# EAGLE design dev (EAGLE 8.5.0)
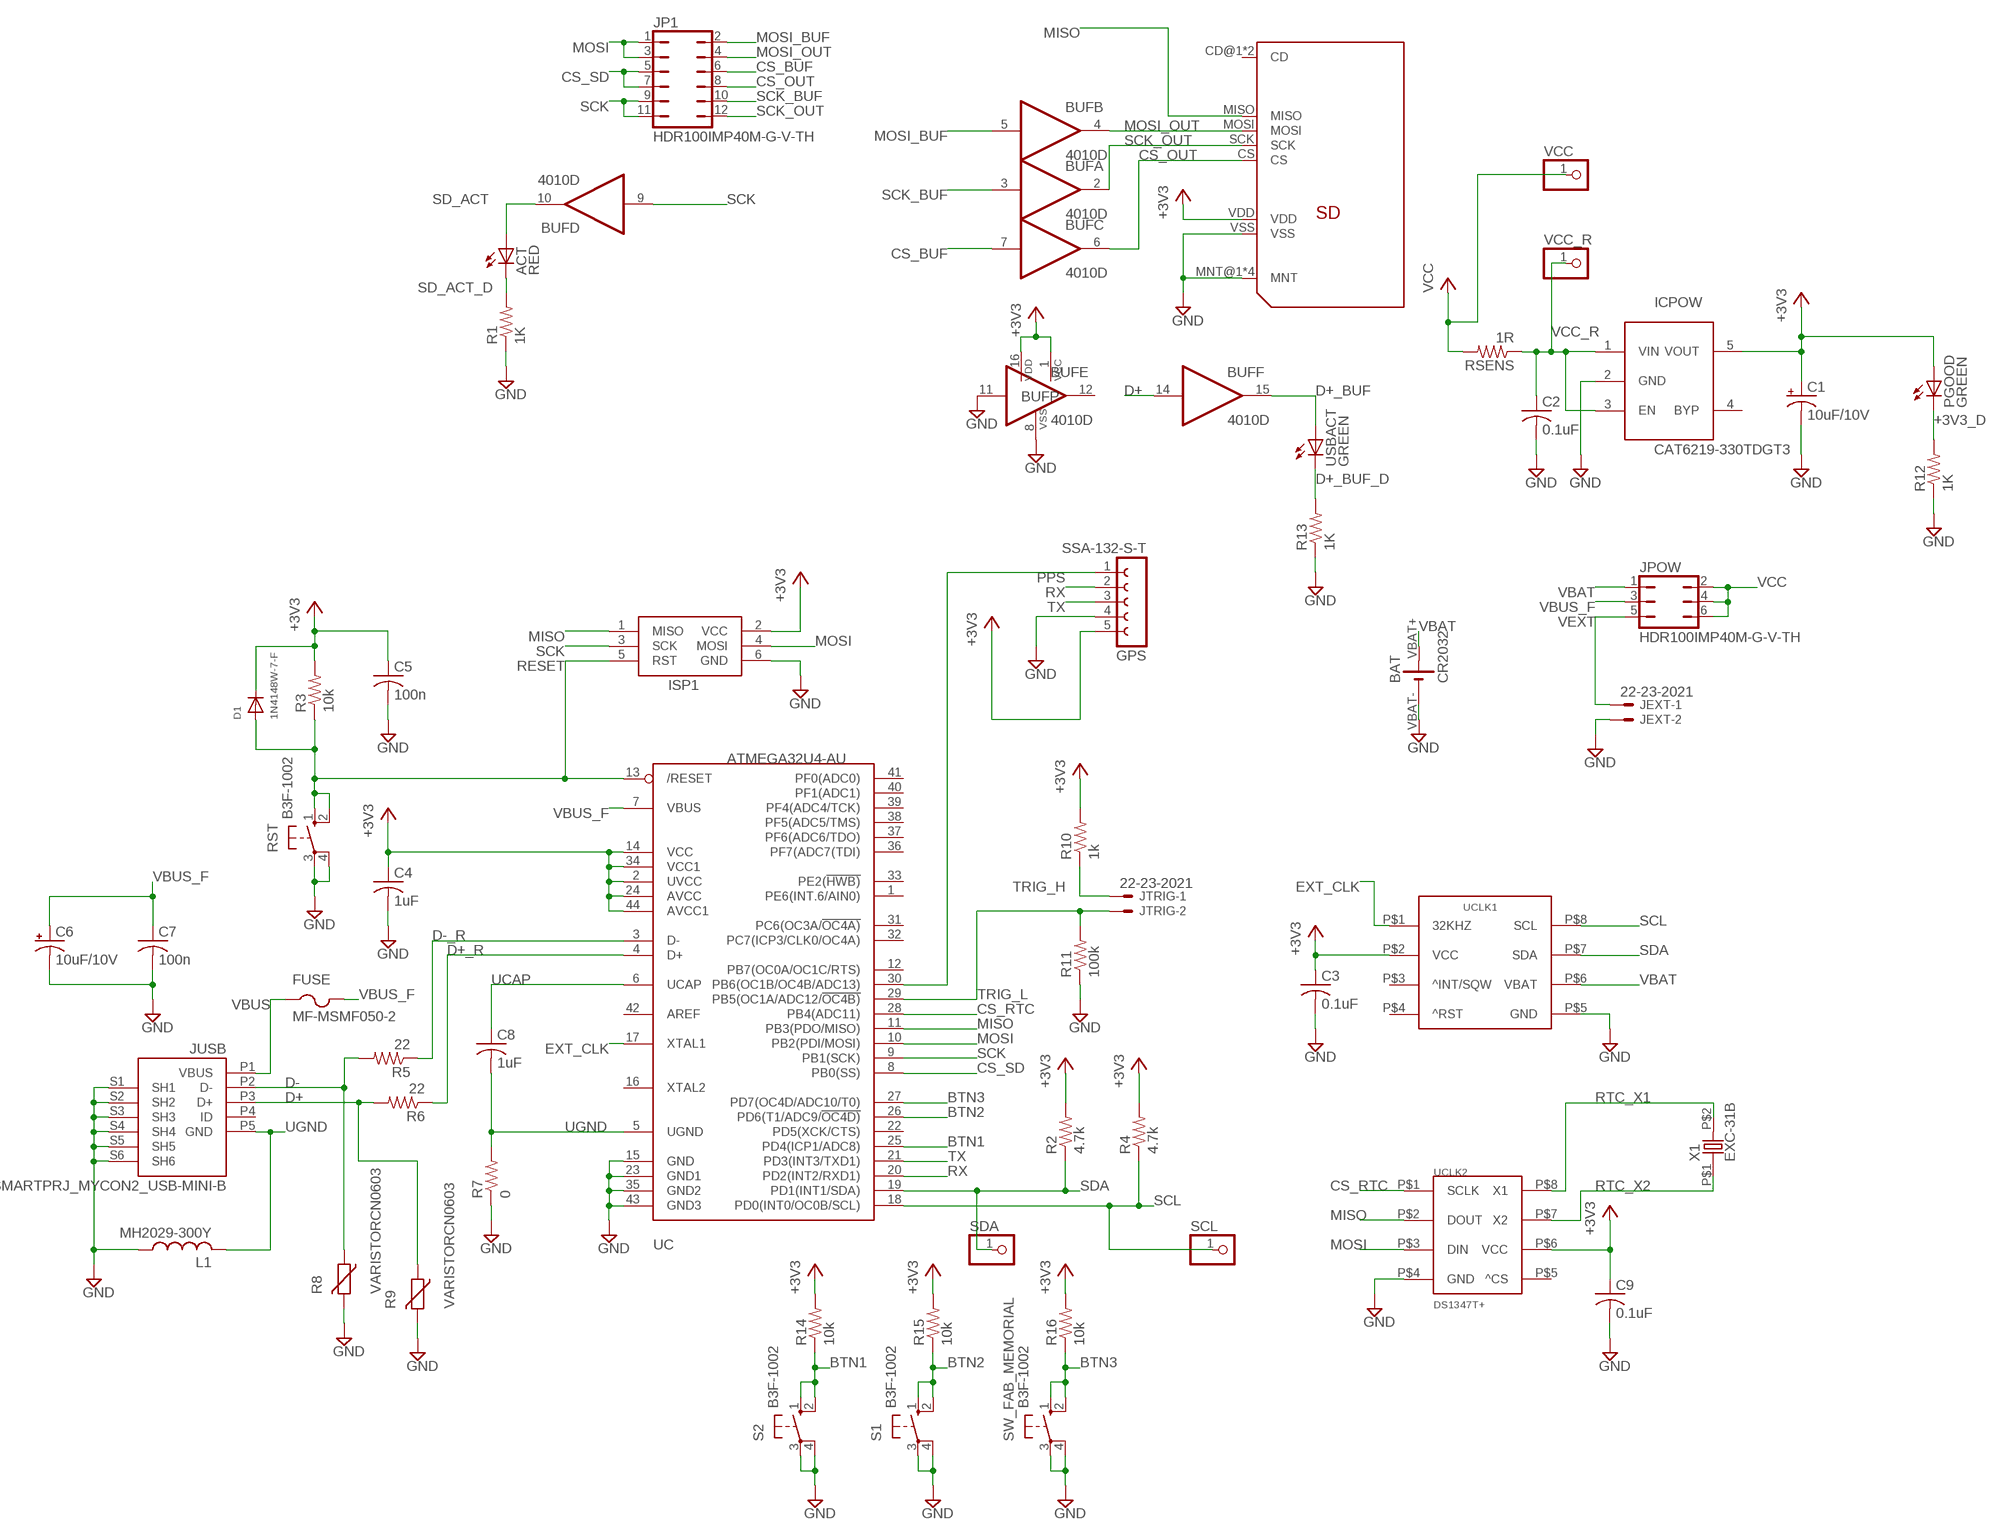
[diagram p0: schematic, sheet 1]

## Parts
ACT  RED  LEDCHIP-LED0603  [CHIP-LED0603]
BAT  CR2032  [BS-7]
BUF  4010D  [SO16]
C1  10uF/10V  CPOL-USA/3216-18R  [A/3216-18R]
C2  0.1uF  C-USC0603K  [C0603K]
C3  0.1uF  C-USC0603K  [C0603K]
C4  1uF  C-USC0603  [C0603]
C5  100n  C-USC0603  [C0603]
C6  10uF/10V  CPOL-USA/3216-18R  [A/3216-18R]
C7  100n  C-USC0603  [C0603]
C8  1uF  C-USC0603  [C0603]
C9  0.1uF  C-USC0603K  [C0603K]
D1  1N4148W-7-F  DIODESOD-123  [SOD-123]
FUSE  MF-MSMF050-2  PTCFUSE-1812  [1812]
GPS  SSA-132-S-T  FE05-1  [FE05-1]
ICPOW  CAT6219-330TDGT3  LP298XS  [SOT23-5L]
ISP1  AVRISP-6  [AVRISP]
JEXT  22-23-2021  [22-23-2021]
JP1  HDR100IMP40M-G-V-TH  JP6Q  [JP6Q]
JPOW  HDR100IMP40M-G-V-TH  JP3Q  [JP3Q]
JTRIG  22-23-2021  [22-23-2021]
JUSB  SMARTPRJ_MYCON2_USB-MINI-B  [SMARTPRJ_CON2_USB_MICRO_B_AT]
L1  MH2029-300Y  [C0805]
PGOOD  GREEN  LEDCHIP-LED0603  [CHIP-LED0603]
R1  1K  R-US_R0603  [R0603]
R2  4.7k  R-US_R0603  [R0603]
R3  10k  R-US_R0603  [R0603]
R4  4.7k  R-US_R0603  [R0603]
R5  22  R-US_R0603  [R0603]
R6  22  R-US_R0603  [R0603]
R7  0  R-US_R0603  [R0603]
R8  VARISTORCN0603  [CT/CN0603]
R9  VARISTORCN0603  [CT/CN0603]
R10  1k  R-US_R0603  [R0603]
R11  100k  R-US_R0603  [R0603]
R12  1K  R-US_R0603  [R0603]
R13  1K  R-US_R0603  [R0603]
R14  10k  R-US_R0603  [R0603]
R15  10k  R-US_R0603  [R0603]
R16  10k  R-US_R0603  [R0603]
RSENS  1R  R-US_R0603  [R0603]
RST  B3F-1002  10-XX  [B3F-10XX]
S1  B3F-1002  10-XX  [B3F-10XX]
S2  B3F-1002  10-XX  [B3F-10XX]
SCL  PINHD-1X1  [1X01]
SDA  PINHD-1X1  [1X01]
SW_FAB_MEMORIAL  B3F-1002  10-XX  [B3F-10XX]
U$1  MICROSD  [MICROSD]
UC  ATMEGA32U4-AU  [TQFP44]
UCLK1  DS3231MDS3231MZ+  [S8MK+1]
UCLK2  DS1347T+  [8_TDFN-EP]
USBACT  GREEN  LEDCHIP-LED0603  [CHIP-LED0603]
VCC  PINHD-1X1  [1X01]
VCC_R  PINHD-1X1  [1X01]
X1  EXC-31B  [XTAL-SM2]

## Nets
+3V3: BUF.1(P:VCC) BUF.16(P:VDD) C1.+ C3.1 C4.1 C5.1 C9.1 D1.C GPS.5 ICPOW.5(VOUT) ISP1.2(VCC) PGOOD.A R2.2 R3.2 R4.2 R10.2 R14.2 R15.2 R16.2 U$1.VDD UC.2(UVCC) UC.14(VCC) UC.24(AVCC) UC.34(VCC1) UC.44(AVCC1) UCLK1.P$2(VCC) UCLK2.P$6(VCC)
+3V3_D: PGOOD.C R12.2
BTN1: R14.1 S2.1(S) S2.2(S1) UC.25(PD4(ICP1/ADC8))
BTN2: R15.1 S1.1(S) S1.2(S1) UC.26(PD6(T1/ADC9/!OC4D))
BTN3: R16.1 SW_FAB_MEMORIAL.1(S) SW_FAB_MEMORIAL.2(S1) UC.27(PD7(OC4D/ADC10/T0))
CS_BUF: BUF.7(C:I) JP1.6
CS_OUT: BUF.6(C:O) JP1.8 U$1.CS
CS_RTC: UC.28(PB4(ADC11)) UCLK2.P$1(SCLK)
CS_SD: JP1.5 JP1.7 UC.8(PB0(SS))
D+: BUF.14(F:I) JUSB.P3(D+) R6.2 R9.1
D+_BUF: BUF.15(F:O) USBACT.A
D+_BUF_D: R13.2 USBACT.C
D+_R: R6.1 UC.4(D+)
D-: JUSB.P2(D-) R5.2 R8.1
D-_R: R5.1 UC.3(D-)
EXT_CLK: UC.17(XTAL1) UCLK1.P$1(32KHZ)
GND: BAT.VBAT-(-) BUF.8(P:VSS) BUF.11(E:I) C1.- C2.2 C3.2 C4.2 C5.2 C6.- C7.2 C9.2 GPS.4 ICPOW.2(GND) ISP1.6(GND) JEXT.2 JUSB.S1(SH1) JUSB.S2(SH2) JUSB.S3(SH3) JUSB.S4(SH4) JUSB.S5(SH5) JUSB.S6(SH6) L1.1 R1.1 R7.1 R8.2 R9.2 R11.1 R12.1 R13.1 RST.3(P) RST.4(P1) S1.3(P) S1.4(P1) S2.3(P) S2.4(P1) SW_FAB_MEMORIAL.3(P) SW_FAB_MEMORIAL.4(P1) U$1.MNT@1(MNT) U$1.MNT@2(MNT) U$1.MNT@3(MNT) U$1.MNT@4(MNT) U$1.VSS UC.15(GND) UC.23(GND1) UC.35(GND2) UC.43(GND3) UCLK1.P$5(GND) UCLK2.P$4(GND)
MISO: ISP1.1(MISO) U$1.MISO UC.11(PB3(PDO/MISO)) UCLK2.P$2(DOUT)
MOSI: ISP1.4(MOSI) JP1.1 JP1.3 UC.10(PB2(PDI/MOSI)) UCLK2.P$3(DIN)
MOSI_BUF: BUF.5(B:I) JP1.2
MOSI_OUT: BUF.4(B:O) JP1.4 U$1.MOSI
PPS: GPS.1 UC.30(PB6(OC1B/OC4B/ADC13))
RESET: D1.A ISP1.5(RST) R3.1 RST.1(S) RST.2(S1) UC.13(/RESET)
RTC_X1: UCLK2.P$8(X1) X1.P$2
RTC_X2: UCLK2.P$7(X2) X1.P$1
RX: GPS.2 UC.20(PD2(INT2/RXD1))
SCK: BUF.9(D:I) ISP1.3(SCK) JP1.9 JP1.11 UC.9(PB1(SCK))
SCK_BUF: BUF.3(A:I) JP1.10
SCK_OUT: BUF.2(A:O) JP1.12 U$1.SCK
SCL: R4.1 SCL.1 UC.18(PD0(INT0/OC0B/SCL)) UCLK1.P$8(SCL)
SD_ACT: ACT.A BUF.10(D:O)
SD_ACT_D: ACT.C R1.2
SDA: R2.1 SDA.1 UC.19(PD1(INT1/SDA)) UCLK1.P$7(SDA)
TRIG_H: JTRIG.1 R10.1
TRIG_L: JTRIG.2 R11.2 UC.29(PB5(OC1A/ADC12/!OC4B))
TX: GPS.3 UC.21(PD3(INT3/TXD1))
UCAP: C8.1 UC.6(UCAP)
UGND: C8.2 JUSB.P5(GND) L1.2 R7.2 UC.5(UGND)
VBAT: BAT.VBAT+(+) JPOW.1 UCLK1.P$6(VBAT)
VBUS: FUSE.1 JUSB.P1(VBUS)
VBUS_F: C6.+ C7.1 FUSE.2 JPOW.3 UC.7(VBUS)
VCC: JPOW.2 JPOW.4 JPOW.6 RSENS.2 VCC.1
VCC_R: C2.1 ICPOW.1(VIN) ICPOW.3(EN) RSENS.1 VCC_R.1
VEXT: JEXT.1 JPOW.5
Unconnected: BUF.12(E:O) ICPOW.4(BYP) JUSB.P4(ID) U$1.CD@1(CD) U$1.CD@2(CD) UC.1(PE6(INT.6/AIN0)) UC.12(PB7(OC0A/OC1C/RTS)) UC.16(XTAL2) UC.22(PD5(XCK/CTS)) UC.31(PC6(OC3A/!OC4A)) UC.32(PC7(ICP3/CLK0/OC4A)) UC.33(PE2(!HWB)) UC.36(PF7(ADC7(TDI)) UC.37(PF6(ADC6/TDO)) UC.38(PF5(ADC5/TMS)) UC.39(PF4(ADC4/TCK)) UC.40(PF1(ADC1)) UC.41(PF0(ADC0)) UC.42(AREF) UCLK1.P$3(^INT/SQW) UCLK1.P$4(^RST) UCLK2.P$5(^CS)

## Library data of the parts
ACT PGOOD USBACT = adafruit:LED: LED OSRAM: - CHIPLED LG R971, LG N971, LY N971, LG Q971, LY Q971, LO R971, LY R971 LH N974, LH R974 LS Q976, LO Q976, LY Q976 LO Q996 - Hyper CHIPLED LW Q18S LB Q993, LB Q99A, LB R99A - SideLED LS A670, LO A670, LY A670, LG A670, LP A670 LB A673, LV A673, LT A673, LW A673 LH A674 LY A675 LS A676, LA A676, LO A676, LY A676, LW A676 LS A679, LY A679, LG A679 - Hyper Micro SIDELED® LS Y876, LA Y876, LO Y876, LY Y876 LT Y87S - SmartLED LW L88C, LW L88S LB L89C, LB L89S, LG L890 LS L89K, LO L89K, LY L89K LS L896, LA L896, LO L896, LY L896 - TOPLED LS T670, LO T670, LY T670, LG T670, LP T670 LSG T670, LSP T670, LSY T670, LOP T670, LYG T670 LG T671, LOG T671, LSG T671 LB T673, LV T673, LT T673, LW T673 LH T674 LS T676, LA T676, LO T676, LY T676, LB T676, LH T676, LSB T676, LW T676 LB T67C, LV T67C, LT T67C, LS T67K, LO T67K, LY T67K, LW E67C LS E67B, LA E67B, LO E67B, LY E67B, LB E67C, LV E67C, LT E67C LW T67C LS T679, LY T679, LG T679 LS T770, LO T770, LY T770, LG T770, LP T770 LB T773, LV T773, LT T773, LW T773 LH T774 LS E675, LA E675, LY E675, LS T675 LS T776, LA T776, LO T776, LY T776, LB T776 LHGB T686 LT T68C, LB T68C - Hyper Mini TOPLED® LB M676 - Mini TOPLED Santana® LG M470 LS M47K, LO M47K, LY M47K Source: http://www.osram.convergy.de/
BAT = dorskyee:CR2032
BUF = 40xx:4010: Hex BUFFER, non-inverting Source: www.fairchildsemi.com CD4010.pdf © 2000 Fairchild Semiconductor Corporation DS005945
C1 C6 = adafruit:CPOL-US: POLARIZED CAPACITOR, American symbol
C2 C3 C9 = adafruit:C-US: CAPACITOR, American symbol
C4 C5 C7 C8 = rcl:C-US: CAPACITOR, American symbol; SPICEPREFIX: C
D1 = adafruit:DIODE: Diode SMADIODE - SMA Surface Mount Package 20V 1A Schottky Diode Digikey: 641-1014-6-ND DO-1N4148 - Through Hole Small Current Diode SOD-123 20V 1 A (.5mV Vf) Schottky Diode - Digikey: MBRX120TPMSCT-ND SOD-323 10V 570mA (.38mV Vf, 3ns) Schottky Diode - Digikey: ZLLS410CT-ND SOD-523 30V 30mA Schottky Diode (RB751S-40TE61) - Digikey: RB751S-40TE61CT-ND SOT23-R/W - SOT23 Package (R = Solder Paste/Reflow Ovens, W = Hand-Soldering) BAT54Film 40V 300mA - Digikey: 497-7162-1-ND
FUSE = adafruit:PTCFUSE: PTC fuses, resettable thermistors
GPS = con-lsta:FE05-1: FEMALE HEADER; OC_FARNELL: unknown; OC_NEWARK: unknown
ICPOW = adafruit:LP298X
ISP1 = adafruit:AVRISP: AVR ISP HEADER Standard 6 pin header for AVR programming
JEXT JTRIG = con-molex:22-23-2021: .100" (2.54mm) Center Header - 2 Pin; MF: MOLEX; MPN: 22-23-2021; OC_FARNELL: 1462926; OC_NEWARK: 25C3832
JP1 = jumper:JP6Q: JUMPER
JPOW = jumper:JP3Q: JUMPER
JUSB = dorskyee:SMARTPRJ_MYCON2_USB-MINI-B
L1 = dorskyee:MH2029-300Y
R1 R12 R13 RSENS = adafruit:R-US_: RESISTOR, American symbol
R2-R7 R10 R11 R14-R16 = resistor:R-US_: RESISTOR, American symbol
R8 R9 = varistor:VARISTOR: VARISTOR
RST S1 S2 SW_FAB_MEMORIAL = switch-omron:10-XX: OMRON SWITCH; MPN: B3F-1000; OC_FARNELL: 176432; OC_NEWARK: 36M3542
SCL SDA VCC VCC_R = adafruit:PINHD-1X1: Pin header 1x1 for 0.1" spacing With round pins
U$1 = dorskyee:MICROSD
UC = adafruit:ATMEGA32U4: http://www.ladyada.net/library/eagle
UCLK1 = dorskyee:DS3231M
UCLK2 = dorskyee:DS1347T+
X1 = dorskyee:EXC-31B

## Net classes
0 default: width 0.254 mm, drill 0.305 mm, clearance 0.254 mm
1 power: width 0.254 mm, drill 0.305 mm, clearance 0.254 mm
2 gnd: width 0.254 mm, drill 0.305 mm, clearance 0.254 mm
3 usbvcc: width 0.254 mm, drill 0.305 mm, clearance 0.254 mm
4 aref: width 0.254 mm, drill 0.305 mm, clearance 0.254 mm

## Board
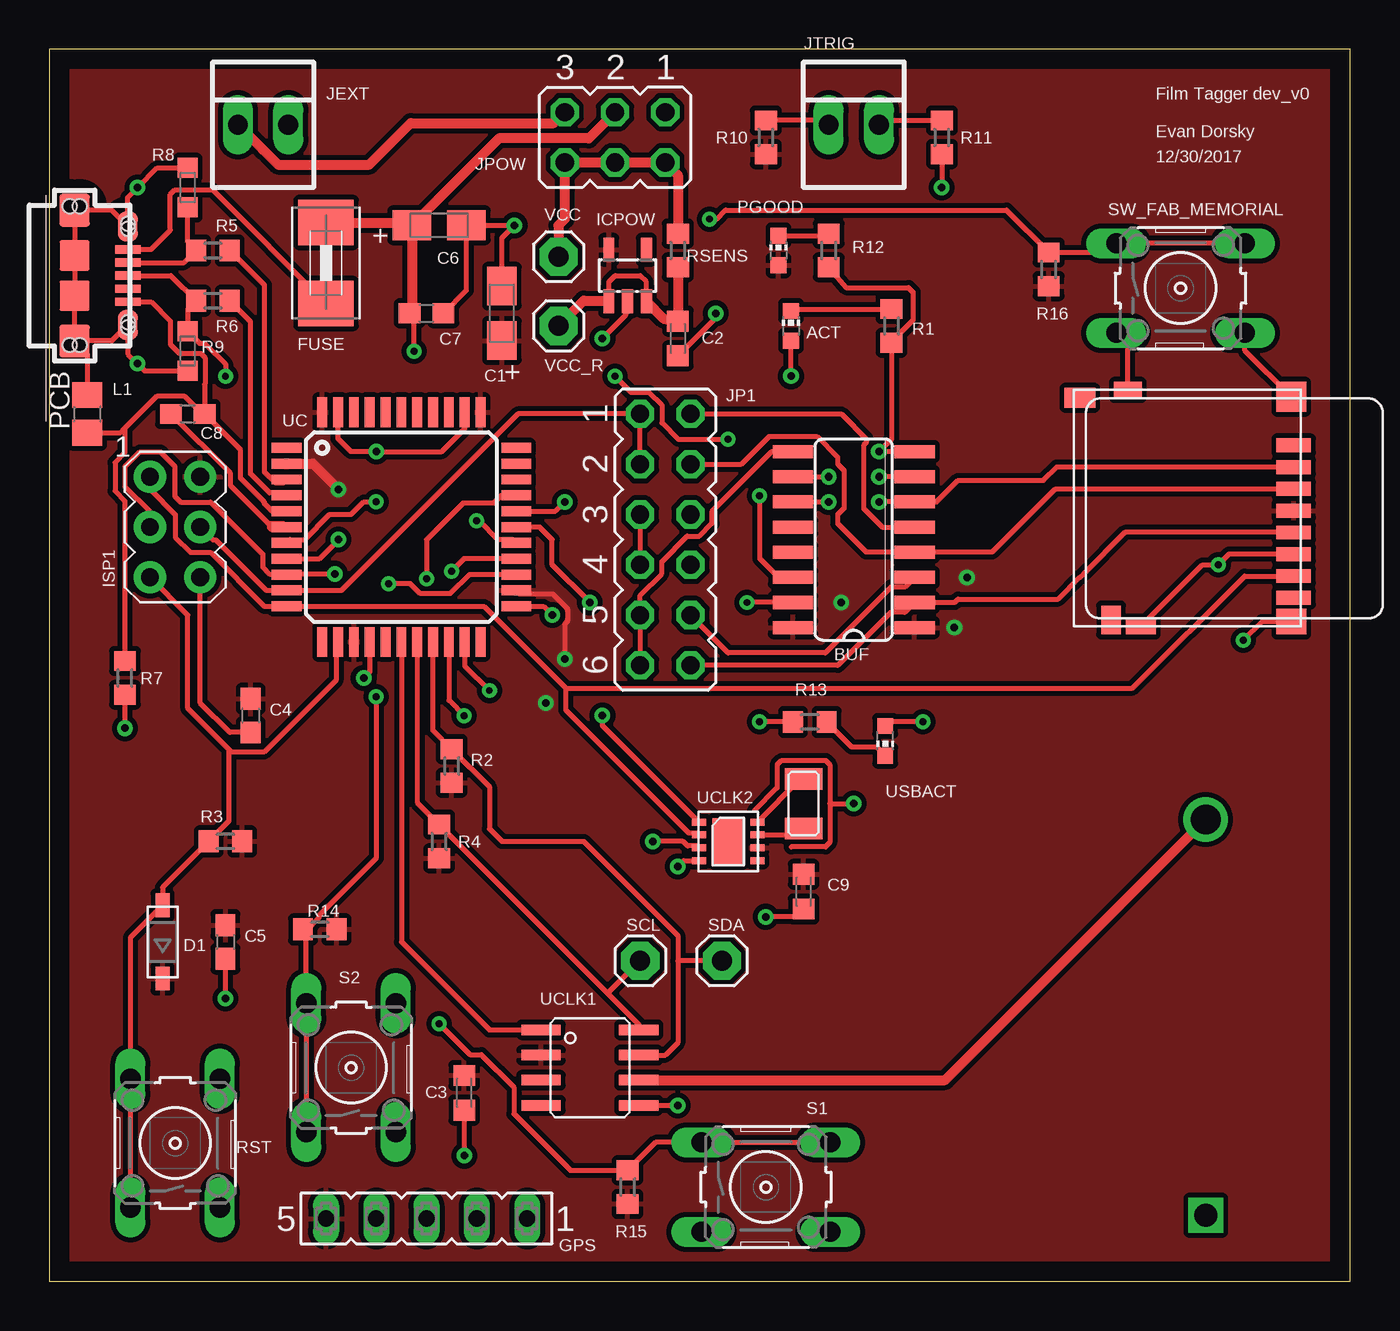
[diagram p1: board, top side]
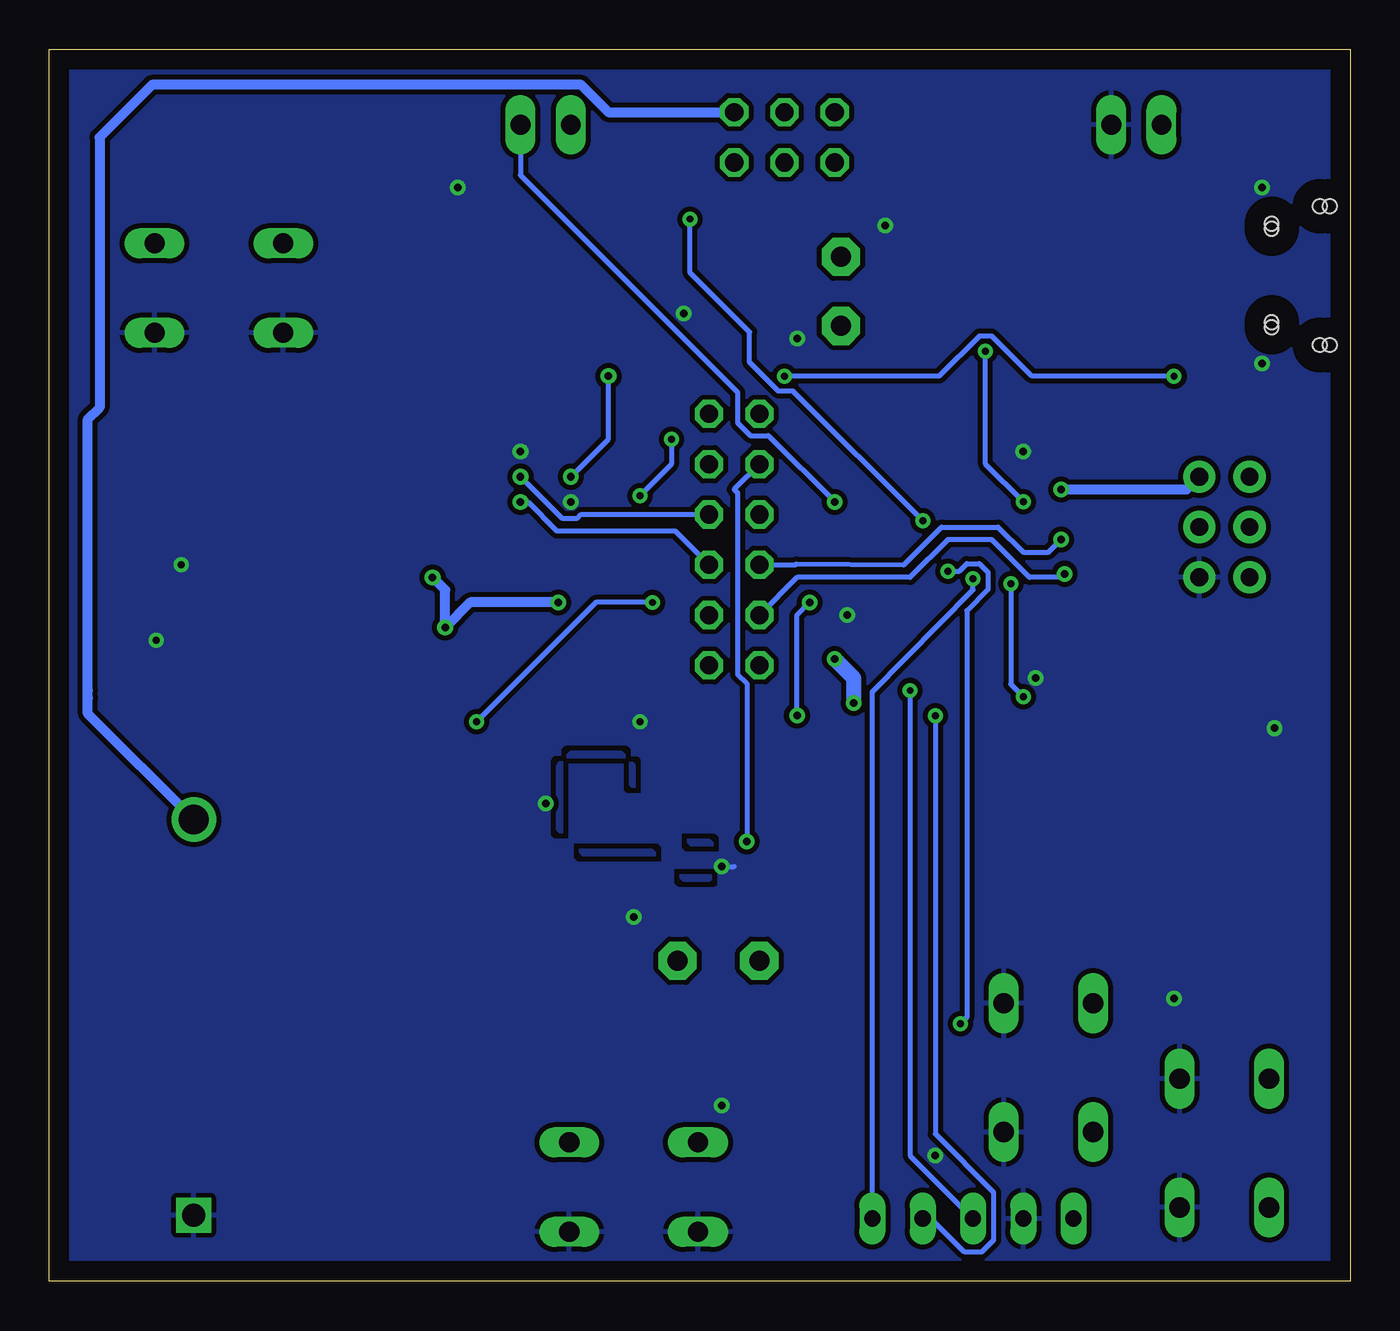
[diagram p2: board, bottom side, seen from below]

Size 65.71 x 62.22 mm. Coordinates in mm from the lower left corner, seen from the top.
Outline: 0,0 65.71,0 65.71,62.22 0,62.22 0,0
Copper layers (1*16): Top 0.035mm / dielectric 1.5mm / Bottom 0.035mm
Design rules "default *": minimum track width 6mil, minimum drill 12mil, track to track 6mil, track to pad 8mil, pad to pad 6mil, via to via 6mil, smd to smd 6mil, copper to edge 40mil, drill to drill 6mil, minimum pad ring 10mil, minimum via ring 8mil, stop-mask expansion 4mil, vias tented up to drill 0mil, thermal gap 10mil

### Footprints (pad centres in the part's own frame; a part is rotated, then mirrored left to right if it is on the bottom)
CHIP-LED0603 = smd 0.8 x 0.8: A 0,-0.75; C 0,0.75
BS-7 = drill 1.5: VBAT+ 10,0 | drill 1.17 square: VBAT- -10,0
SO16 = smd 0.66 x 2.032: 1 -4.445,-3.073; 2 -3.175,-3.073; 3 -1.905,-3.073; 4 -0.635,-3.073; 5 0.635,-3.073; 6 1.905,-3.073; 7 3.175,-3.073; 8 4.445,-3.073; 9 4.445,3.073; 10 3.175,3.073; 11 1.905,3.073; 12 0.635,3.073; 13 -0.635,3.073; 14 -1.905,3.073; 15 -3.175,3.073; 16 -4.445,3.073
A/3216-18R = smd 1.95 x 1.5: + 1.375,0; - -1.375,0
C0603K = smd 1.05 x 1.08: 1 -0.875,0; 2 0.875,0
C0603 = smd 1.1 x 1: 1 -0.85,0; 2 0.85,0
SOD-123 = smd 1.2 x 0.7: A 1.85,0; C -1.85,0
1812 = smd 2.286 x 2.794: 1 -2.046,0; 2 2.046,0
FE05-1 = drill 0.813 long: 1 -5.08,0; 2 -2.54,0; 3 0,0; 4 2.54,0; 5 5.08,0
SOT23-5L = smd 0.55 x 1.2: 1 -0.95,-1.3; 2 0,-1.3; 3 0.95,-1.3; 4 0.95,1.3; 5 -0.95,1.3
AVRISP = drill 0.9 pad 1.626: 1 -1.27,2.54; 2 1.27,2.54; 3 -1.27,0; 4 1.27,0; 5 -1.27,-2.54; 6 1.27,-2.54
22-23-2021 = drill 1 long: 1 -1.27,0; 2 1.27,0
JP6Q = drill 0.914 octagon: 1 -6.35,-1.27; 2 -6.35,1.27; 3 -3.81,-1.27; 4 -3.81,1.27; 5 -1.27,-1.27; 6 -1.27,1.27; 7 1.27,-1.27; 8 1.27,1.27; 9 3.81,-1.27; 10 3.81,1.27; 11 6.35,-1.27; 12 6.35,1.27
JP3Q = drill 0.914 octagon: 1 -2.54,-1.27; 2 -2.54,1.27; 3 0,-1.27; 4 0,1.27; 5 2.54,-1.27; 6 2.54,1.27
SMARTPRJ_CON2_USB_MICRO_B_AT = smd 0.406 x 1.346: P1 -1.321,2.692; P2 -0.66,2.692; P3 0,2.692; P4 0.66,2.692; P5 1.321,2.692 | smd 1.651 x 1.549: S1 -3.302,0; S2 3.302,0 | smd 1.524 x 1.016: S3 -2.489,2.692; S4 2.489,2.692 | smd 1.524 x 1.524: S5 -1.016,0; S6 1.016,0 | hole 0.7: -3.505,0.254; -3.505,-0.254; 3.505,0.254; 3.505,-0.254; -2.616,2.692; -2.362,2.692; 2.362,2.692; 2.616,2.692
C0805 = smd 1.3 x 1.5: 1 -0.95,0; 2 0.95,0
R0603 = smd 1 x 1.1: 1 -0.85,0; 2 0.85,0
CT/CN0603 = smd 1 x 1: 1 -1,0; 2 1,0
B3F-10XX = drill 1.016 long: 1 -3.251,2.261; 2 3.251,2.261; 3 -3.251,-2.261; 4 3.251,-2.261
1X01 = drill 1.016 pad 1.93 octagon: 1 0,0
MICROSD = smd 1 x 1.55: CD@1 2.4,10.8 | smd 1.45 x 1: CD@2 -8.825,9.225 | smd 0.7 x 1.75: CS -1.1,0; MISO -6.6,0; MOSI -2.2,0; NC@1 0,0; NC@2 -7.7,0; SCK -4.4,0; VDD -3.3,0; VSS -5.5,0 | smd 1.3 x 1.5: MNT@1 -8.9,0.125 | smd 0.8 x 1.5: MNT@2 -9.15,7.725 | smd 0.8 x 1.4: MNT@3 2.8,8.375 | smd 1.5 x 1.5: MNT@4 2.45,0.125
TQFP44 = smd 1.5 x 0.5: 1 -5.8,4; 2 -5.8,3.2; 3 -5.8,2.4; 4 -5.8,1.6; 5 -5.8,0.8; 6 -5.8,0; 7 -5.8,-0.8; 8 -5.8,-1.6; 9 -5.8,-2.4; 10 -5.8,-3.2; 11 -5.8,-4; 23 5.8,-4; 24 5.8,-3.2; 25 5.8,-2.4; 26 5.8,-1.6; 27 5.8,-0.8; 28 5.8,0; 29 5.8,0.8; 30 5.8,1.6; 31 5.8,2.4; 32 5.8,3.2; 33 5.8,4 | smd 0.5 x 1.5: 12 -4,-5.8; 13 -3.2,-5.8; 14 -2.4,-5.8; 15 -1.6,-5.8; 16 -0.8,-5.8; 17 0,-5.8; 18 0.8,-5.8; 19 1.6,-5.8; 20 2.4,-5.8; 21 3.2,-5.8; 22 4,-5.8; 34 4,5.8; 35 3.2,5.8; 36 2.4,5.8; 37 1.6,5.8; 38 0.8,5.8; 39 0,5.8; 40 -0.8,5.8; 41 -1.6,5.8; 42 -2.4,5.8; 43 -3.2,5.8; 44 -4,5.8
S8MK+1 = smd 1.98 x 0.53: P$1 -2.465,1.905; P$2 -2.465,0.635; P$3 -2.465,-0.635; P$4 -2.465,-1.905; P$5 2.465,-1.905; P$6 2.465,-0.635; P$7 2.465,0.635; P$8 2.465,1.905
8_TDFN-EP = smd 0.7 x 0.35: P$1 -1.475,0.975; P$2 -1.475,0.325; P$3 -1.475,-0.325; P$4 -1.475,-0.975; P$5 1.475,-0.975; P$6 1.475,-0.325; P$7 1.475,0.325; P$8 1.475,0.975 | smd 1.58 x 2.35: P$9 0,0
XTAL-SM2 = smd 1.1 x 1.9: P$1 -1.25,0; P$2 1.25,0

### Placement (x,y rotation side)
ACT  37.47,48.26 0 top
BAT  58.42,13.34 90 top
BUF  40.64,37.47 90 top
C1  22.86,48.9 270 top
C2  31.75,47.62 270 top
C3  20.95,9.53 270 top
C4  10.16,28.57 270 top
C5  8.89,17.14 270 top
C6  19.68,53.34 180 top
C7  19.05,48.9 0 top
C8  6.99,43.81 0 top
C9  38.1,19.68 270 top
D1  5.71,17.14 90 top
FUSE  13.97,51.44 90 top
GPS  19.05,3.17 180 top
ICPOW  29.21,50.8 0 top
ISP1  6.35,38.1 0 top
JEXT  10.79,58.42 0 top
JP1  31.11,37.47 270 top
JPOW  28.57,57.78 180 top
JTRIG  40.64,58.42 0 top
JUSB  1.27,50.8 270 top
L1  1.91,43.81 270 top
PGOOD  36.83,52.07 0 top
R1  42.55,48.26 90 top
R2  20.32,26.04 270 top
R3  8.89,22.23 0 top
R4  19.68,22.23 270 top
R5  8.26,52.07 180 top
R6  8.26,49.53 180 top
R7  3.81,30.48 90 top
R8  6.99,55.24 90 top
R9  6.99,46.99 270 top
R10  36.2,57.78 270 top
R11  45.09,57.78 90 top
R12  39.37,52.07 90 top
R13  38.42,28.26 0 top
R14  13.65,17.78 0 top
R15  29.21,4.76 270 top
R16  50.48,51.12 270 top
RSENS  31.75,52.07 90 top
RST  6.35,6.99 90 top
S1  36.2,4.76 0 top
S2  15.24,10.79 90 top
SCL  29.84,16.19 0 top
SDA  33.97,16.19 0 top
SW_FAB_MEMORIAL  57.15,50.16 0 top
U$1  62.87,42.23 90 top
UC  17.78,38.1 0 top
UCLK1  27.3,10.79 0 top
UCLK2  34.29,22.23 0 top
USBACT  42.23,27.3 180 top
VCC  25.72,51.75 0 top
VCC_R  25.72,48.26 0 top
X1  38.1,24.13 90 top

### Tracks (layer width: path | path; a pad name or v marks a point on that pad's centre or on a via)
+3V3  (via drill 0.38, 0.38 pad 0.38)
  Top 0.254: UC.24 23.75,34.73 25.42,34.73 26.18,33.98 26.18,33.33 26.04,33.19 v26.04,31.43
  Top 0.508: UC.2 13.31,41.3 v14.61,40.01
  Bottom 0.508: v14.61,40.01 8.26,40.01 ISP1.2 | v40.01,34.29 44.45,34.29 v45.72,33.02 45.72,34.92 v46.35,35.56
  Bottom 0.762: v26.04,31.43 25.08,30.48 v25.08,29.21
  pour Top: 0,62.23 65.41,62.23 65.41,0 0,0
  cutout Top: 35.56,23.5 36.83,24.77 36.83,26.04 39.37,26.04 39.37,22.23 35.56,22.23
  pour Bottom (isolate 0.254, rank 2): 33.66,22.23 36.2,24.77 36.2,26.04 36.83,26.67 39.37,26.67 40.01,26.04 40.01,22.86 38.73,21.59 34.92,21.59 33.66,20.32 32.38,20.32 31.75,20.95 31.75,21.59 32.38,22.23
+3V3_D
  Top 0.254: PGOOD.C 39.27,52.82 R12.2
BTN1  (via drill 0.35)
  Top 0.254: S2.1 S2.2 12.98,17.6 12.91,17.67 | 12.91,17.67 R14.1 | UC.25 21.22,35.7 20.25,34.73 18.74,34.73 18.23,35.24 v17.14,35.24 | 12.91,17.67 13.62,18.38 13.62,18.49 16.51,21.38 v16.51,29.53
  Bottom 0.254: v17.14,35.24 17.14,30.16 v16.51,29.53
BTN2  (via drill 0.35)
  Top 0.254: S1.2 S1.1 30.62,7.02 R15.1 26.32,5.61 23.47,8.47 23.47,9.8 21.81,11.46 21.25,11.46 v19.68,13.02 | UC.26 20.94,36.5 v20.32,35.88
  Bottom 0.254: v20.32,35.88 19.74,35.88 19.36,36.25 18.74,36.25 18.29,35.81 18.29,34.95 19.37,33.88 19.37,13.34 v19.68,13.02
BTN3  (via drill 0.35)
  Top 0.254: SW_FAB_MEMORIAL.2 SW_FAB_MEMORIAL.1 53.44,51.97 R16.1 48.35,54.1 34.17,54.1 33.72,53.66 v33.34,53.66 | UC.27 23.41,37.47 22.67,37.47 21.72,38.42 v21.59,38.42
  Bottom 0.254: v21.59,38.42 28.13,44.96 28.89,44.96 30.34,46.41 30.34,47.95 33.34,50.94 v33.34,53.66
CS_BUF  (via drill 0.38)
  Top 0.254: BUF.7 v41.91,40.64
  Bottom 0.254: JP1.6 38.84,38.73 39.03,38.55 39.82,38.55 v41.91,40.64
CS_OUT  (via drill 0.38)
  Top 0.254: v41.91,39.37 BUF.6 44.82,39.37 45.91,40.46 47.94,40.46 | 47.94,40.46 50.22,40.46 50.89,41.13 U$1.CS | 47.94,40.46
  Bottom 0.254: v41.91,39.37 41.54,39.37 40.08,37.91 34.1,37.91 JP1.8
CS_RTC  (via drill 0.38)
  Top 0.254: UCLK2.P$1 27.94,28.07 v27.94,28.57 | v27.3,34.29 25.4,36.2 25.4,37.47 24.77,38.1 UC.28
  Bottom 0.254: v27.94,28.57 27.94,33.66 v27.3,34.29
CS_SD  (via drill 0.38)
  Top 0.254: UC.8 13.64,36.5 v14.61,37.47 | JP1.5 JP1.7
  Bottom 0.254: JP1.7 28.02,36.2 27.97,36.25 22.54,36.2 20.64,38.1 17.78,38.1 16.51,36.83 15.24,36.83 v14.61,37.47
D+  (via drill 0.35 pad 0.38)
  Top 0.254: JUSB.P3 6.13,50.8 R6.2 6.99,49.11 R9.1 7.6,47.38 7.85,47.38 8.89,46.34 v8.89,45.72 | v34.29,42.55 31.75,42.55 30.94,43.36 30.94,44.27 30.3,44.91 29.39,44.91 v28.57,45.72 | v35.88,39.69 35.88,36.51 36.83,35.56 BUF.14
  Bottom 0.254: v8.89,45.72 16.07,45.72 18.1,47.75 18.73,47.75 20.76,45.72 v28.57,45.72 | v34.29,42.55 34.29,41.27 v35.88,39.69
D+_BUF  (via drill 0.35 pad 0.38)
  Top 0.254: BUF.15 v35.24,34.29 | 44.03,28.36 v44.13,28.26 42.43,28.26 USBACT.A
  Bottom 0.254: v35.24,34.29 38.1,34.29 v44.13,28.26
D+_BUF_D
  Top 0.254: USBACT.C 41.8,26.99 40.54,26.99 R13.2
D+_R
  Top 0.254: UC.4 11.86,39.82 11.12,39.82 10.16,40.78 10.16,48.48 R6.1
D-
  Top 0.254: JUSB.P2 6.79,51.46 R5.2 6.99,52.49 R8.1
D-_R
  Top 0.254: R5.1 10.85,50.33 10.85,40.89 11.07,40.67 11.09,40.67 11.43,40.33 11.81,40.33 UC.3
EXT_CLK
  Top 0.254: UC.17 17.78,17.14 22.23,12.7 UCLK1.P$1
GND  (via drill 0.35, 0.35 pad 0.38, 0.38)
  Top 0.254: BUF.11 v39.37,39.37 | BUF.8 v41.91,41.91 42.55,42.55 R1.1 42.55,47.47 43.63,48.55 43.63,49.97 43.4,50.19 40.25,50.19 R12.1 | v8.89,14.29 C5.2 | C4.2 9.11,27.73 7.62,29.21 ISP1.6 | UC.35 20.98,43.07 19.82,41.91 v16.51,41.91 15.24,41.91 14.58,42.57 UC.43 | UC.15 16.18,30.79 v15.88,30.48 | UC.23 24.95,34.1 v25.4,33.66 | UCLK1.P$5 v31.75,8.89 | C3.2 v20.95,6.35 | JUSB.S2 JUSB.S6 JUSB.S5 JUSB.S1 3.15,54.1 JUSB.S3 3.96,54.76 v4.45,55.24 5.45,56.24 R8.2 | JUSB.S2 3.15,47.5 JUSB.S4 3.96,46.84 v4.45,46.35 4.81,45.99 R9.2 | R7.1 v3.81,27.94 | C7.2 21.06,50.05 C6.- v23.5,53.34 22.86,52.7 C1.- | 39.43,24.13 39.43,26.09 39.21,26.31 36.99,26.31 36.77,26.09 36.77,24.92 35.63,23.78 | 39.43,24.13 39.43,22.17 39.21,21.95 37.47,21.95 | 39.43,24.13 v40.64,24.13 | v31.75,20.95 32.05,21.25 UCLK2.P$4 | R11.1 v45.09,55.24 | JUSB.S2 1.91,46.86 L1.1 | R13.1 v35.88,28.26 | U$1.VSS 59.59,36.73 v59.05,36.2 58.26,36.2 U$1.MNT@2 | U$1.MNT@4 60.4,47.02 SW_FAB_MEMORIAL.4 | U$1.MNT@3 54.49,47.31 SW_FAB_MEMORIAL.3 | U$1.MNT@1 61.27,33.33 v60.33,32.38 | v27.94,47.62 29.13,48.81 29.13,48.89 29.21,48.97 ICPOW.2 | C9.2 37.7,18.41 v36.2,18.41 | C2.2 33.66,48.66 v33.66,48.9
  Bottom 0.254: v31.75,20.95 31.11,20.95
  pour Bottom (rank 6): 65.41,62.23 0,62.23 0,0 65.41,0
  pour Bottom: 36.83,26.04 36.83,24.77 33.66,21.59 32.38,21.59 31.75,20.95 33.66,20.95 34.92,22.23 38.73,22.23 39.37,22.86 39.37,26.04
MISO
  Top 0.254: ISP1.1 5.08,40.01 6.36,38.72 6.36,37.58 7.12,36.82 8.14,36.82 10.86,34.1 UC.11 21.95,34.1 26.09,29.96 | 26.09,29.96 54.72,29.96 60.39,35.63 U$1.MISO | UCLK2.P$2 32.72,22.64 32.31,22.64 26.09,28.86 26.09,29.96
MOSI  (via drill 0.38)
  Top 0.254: JP1.3 JP1.1 23.67,43.81 14.75,34.9 UC.10 10.96,34.9 8.4,37.45 8.27,37.45 ISP1.4 | UCLK2.P$3 32.72,21.99 32.24,21.99 32.01,22.23 v30.48,22.23
  Bottom 0.254: JP1.3 31.11,40.01 30.94,39.83 30.94,30.66 30.48,30.2 v30.48,22.23
MOSI_BUF
  Top 0.254: JP1.2 40.01,43.81 41.27,42.55 41.27,42.37 41.13,42.23 41.13,39.05 42.08,38.1 BUF.5
MOSI_OUT
  Top 0.254: JP1.4 34.96,41.27 36.37,42.69 38.77,42.69 39.82,41.63 39.82,41.29 40.15,40.96 40.15,39.05 39.82,38.72 39.82,38.29 41.27,36.83 BUF.4 47.62,36.83 50.8,40.01 62.84,40.01 U$1.MOSI
PPS  (via drill 0.35)
  Top 0.254: v19.05,35.49 19.05,37.47 20.89,39.31 22.45,39.31 22.84,39.7 UC.30
  Bottom 0.254: GPS.1 24.13,29.78 19.05,34.92 v19.05,35.49
RESET
  Top 0.254: ISP1.5 6.99,33.66 6.99,28.95 9.08,26.86 | UC.13 14.47,32.19 14.47,30.36 10.84,26.73 9.2,26.73 9.08,26.86 | 9.08,26.86 9.08,23.26 R3.1 5.71,19.9 D1.A 4.09,17.37 RST.2 RST.1
RTC_X1
  Top 0.254: UCLK2.P$8 37.95,25.38 X1.P$2
RTC_X2
  Top 0.254: UCLK2.P$7 37.77,22.55 X1.P$1
RX  (via drill 0.35)
  Top 0.254: UC.20 20.18,29.35 v20.95,28.57
  Bottom 0.254: v20.95,28.57 20.95,7.45 18.01,4.5 18.01,2.08 18.62,1.47 19.48,1.47 21.18,3.17 GPS.2
SCK  (via drill 0.38)
  Top 0.254: BUF.9 36.49,41.91 33.48,38.9 33.48,38.28 32.84,37.64 32.22,37.64 30.94,36.36 30.94,35.74 29.84,34.65 JP1.9 JP1.11 | ISP1.3 5.08,38.86 3.82,40.12 3.82,41.16 4.56,41.9 5.6,41.9 6.34,41.16 6.34,39.65 6.63,39.36 8.14,39.36 10.79,36.71 10.79,36.07 11.15,35.7 UC.9 12.02,35.74 v14.43,35.74
  Bottom 0.254: v14.43,35.74 14.61,35.56 16.19,35.56 18.1,37.47 20.32,37.47 22.23,35.56 27.94,35.56 JP1.9
SCK_BUF
  Top 0.254: BUF.3 43.22,35.06 42.51,35.06 39.2,31.75 34.29,31.75 JP1.10
SCK_OUT
  Top 0.254: JP1.12 39.83,31.11 42.51,33.8 43.22,33.8 BUF.2 45.74,34.29 45.91,34.46 50.97,34.46 52.07,35.56 52.23,35.72 54.34,37.83 U$1.SCK
SCL
  Top 0.254: UC.18 18.58,24.18 R4.1 28.21,14.55 | 28.21,14.55 29.77,12.99 UCLK1.P$8 | SCL.1 28.21,14.55
SD_ACT  (via drill 0.38)
  Top 0.254: BUF.10 v39.37,40.64 | v37.47,45.72 ACT.A
  Bottom 0.254: v39.37,40.64 37.47,42.55 v37.47,45.72
SD_ACT_D
  Top 0.254: 42.49,49.31 R1.2 37.56,49.11 ACT.C
SDA
  Top 0.254: UC.19 19.38,27.82 R2.1 22.23,24.98 22.23,22.86 22.86,22.23 26.99,22.23 31.75,17.46 31.75,16.19 | UCLK1.P$7 31.11,11.43 31.75,12.06 31.75,16.19 | SDA.1 31.75,16.19
TRIG_H
  Top 0.254: JTRIG.1 39.16,58.63 R10.1
TRIG_L  (via drill 0.38)
  Top 0.254: JTRIG.2 42.12,58.63 R11.2 | UC.29 25.57,38.9 v26.04,39.37
  Bottom 0.254: v26.04,39.37 29.39,42.72 30.3,42.72 30.94,43.36 30.94,44.91 41.91,55.88 JTRIG.2
TX  (via drill 0.35)
  Top 0.254: UC.21 20.98,31.09 v22.23,29.84
  Bottom 0.254: v22.23,29.84 22.23,6.35 GPS.3
UCAP
  Top 0.254: UC.6 11.81,38.27 11.07,38.27 9.14,40.2 9.14,40.81 C8.1
  Top 0.508: 11.24,38.1 UC.6
UGND
  Top 0.254: C8.2 8.04,43.6 7.93,43.6 6.84,44.7 5.43,44.7 3.81,43.08 | C8.2 7.83,45.3 7.87,45.33 7.87,46.65 7.64,46.87 6.57,46.87 6.1,47.33 6.1,48.51 5.13,49.48 JUSB.P5 | C8.2 9.65,42 9.65,40.57 10.85,39.37 10.85,39.29 11.24,38.9 UC.5 | 3.81,43.08 3.81,41.87 3.31,41.37 3.31,39.91 3.81,39.41 R7.2 | L1.2 3.6,42.87 3.81,43.08
VBAT
  Top 0.508: BAT.VBAT+ 45.24,10.16 UCLK1.P$6
  Bottom 0.508: JPOW.1 37.47,59.05 38.85,60.44 60.53,60.44 63.18,57.78 63.18,44.14 63.77,43.55 63.77,29.84 63.77,29.48 63.77,28.68 BAT.VBAT+
VBUS
  Top 0.254: FUSE.1 8.23,55.13 6.33,55.13 6.1,54.9 6.1,53.09 5.13,52.12 JUSB.P1
VBUS_F  (via drill 0.35)
  Top 0.254: UC.7 12.14,37.47 12.88,37.47 14.15,38.73 15.24,38.73 15.88,39.37 v16.51,39.37 | v18.41,46.99 18.41,48.68 C7.1
  Top 0.508: C6.+ 18.31,49.01 C7.1 | JPOW.3 27.25,57.73 22.7,57.73 C6.+ | 18.62,53.34 C6.+ | FUSE.2 18.17,53.48 C6.+
  Bottom 0.254: v16.51,39.37 18.41,41.27 v18.41,46.99
VCC
  Top 0.508: RSENS.2 31.75,55.88 JPOW.2 JPOW.4 JPOW.6 26.04,53.66 25.72,53.34 VCC.1
VCC_R
  Top 0.254: ICPOW.1 28.26,49.53 28.26,50.48 28.57,50.8 29.84,50.8 30.16,50.48 ICPOW.3
  Top 0.508: RSENS.1 C2.1 31.04,48.62 ICPOW.3 | VCC_R.1 26.99,49.53 28.26,49.53
VEXT
  Top 0.508: JEXT.1 10.79,57.15 10.8,57.15 11.54,56.4 16.16,56.4 18.25,58.5 25.48,58.5 JPOW.5

### Text on the board
tNames: Film Tagger dev_v0 | Evan Dorsky | 12/30/2017